# EAGLE design adaptador_vga_scart (EAGLE 6.5.0)
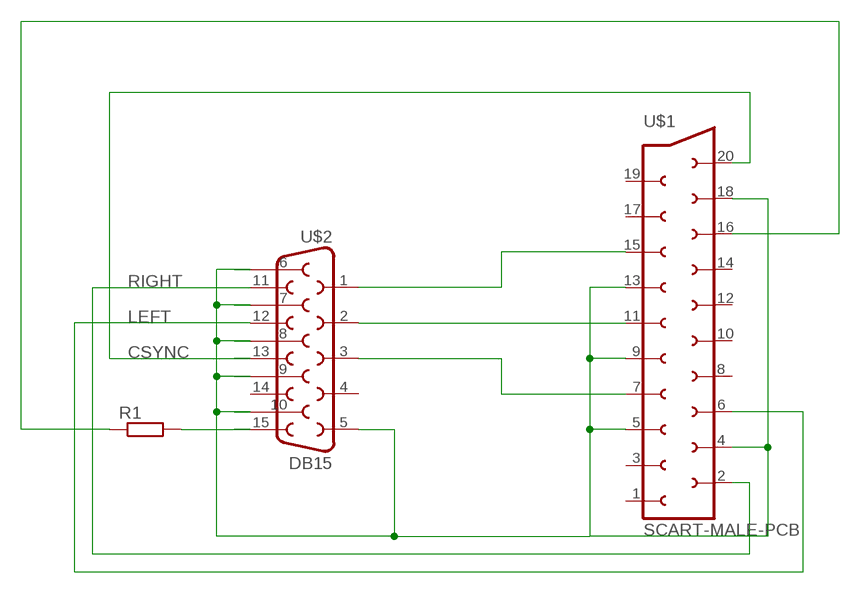
[diagram p0: schematic, sheet 1]

## Parts
R1  R-EU_0204/7  [0204/7]
U$1  SCART-MALE-PCB  [SCART-PCB]
U$2  DB15  [DB15]

## Nets
BOUT: U$1.7 U$2.3
CSYNC: U$1.20 U$2.13
GND: U$1.4 U$1.5 U$1.9 U$1.13 U$1.18 U$2.5 U$2.6 U$2.7 U$2.8 U$2.9 U$2.10
GOUT: U$1.11 U$2.2
LEFT: U$1.6 U$2.12
N$1: U$1.15 U$2.1
N$2: R1.2 U$2.15
N$3: R1.1 U$1.16
RIGHT: U$1.2 U$2.11
Unconnected: U$1.1 U$1.3 U$1.8 U$1.10 U$1.12 U$1.14 U$1.17 U$1.19 U$2.4 U$2.14

## Library data of the parts
R1 = rcl:R-EU_: RESISTOR, European symbol
U$1 = con-hirschmann:SCART-MALE-PCB
U$2 = SparkFun-Connectors:DB15: DB15 / VGA right angle through-hole female connector.

## Board
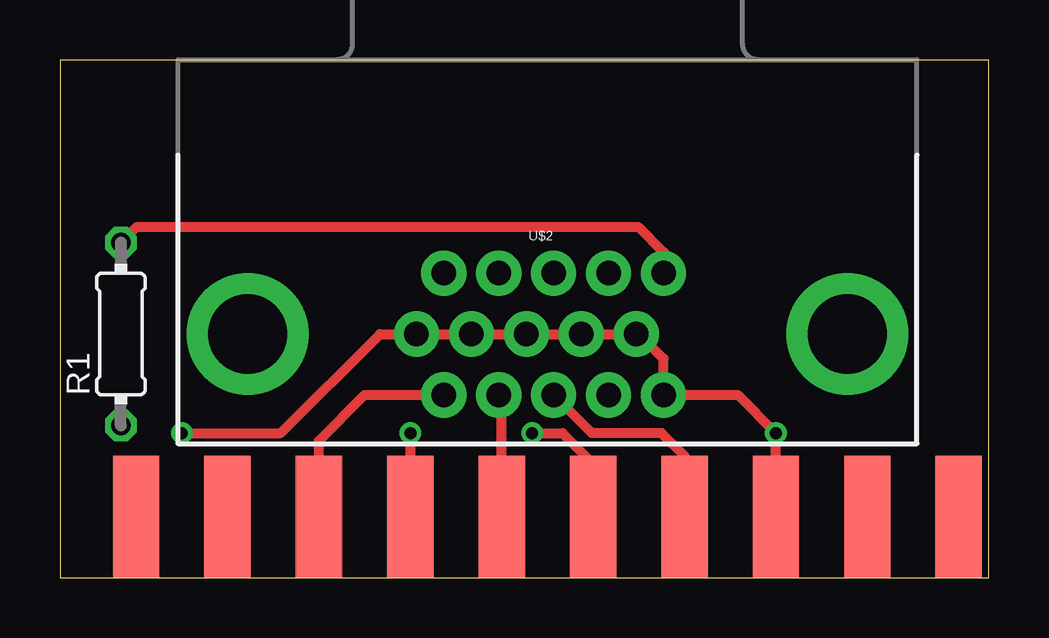
[diagram p1: board, top side]
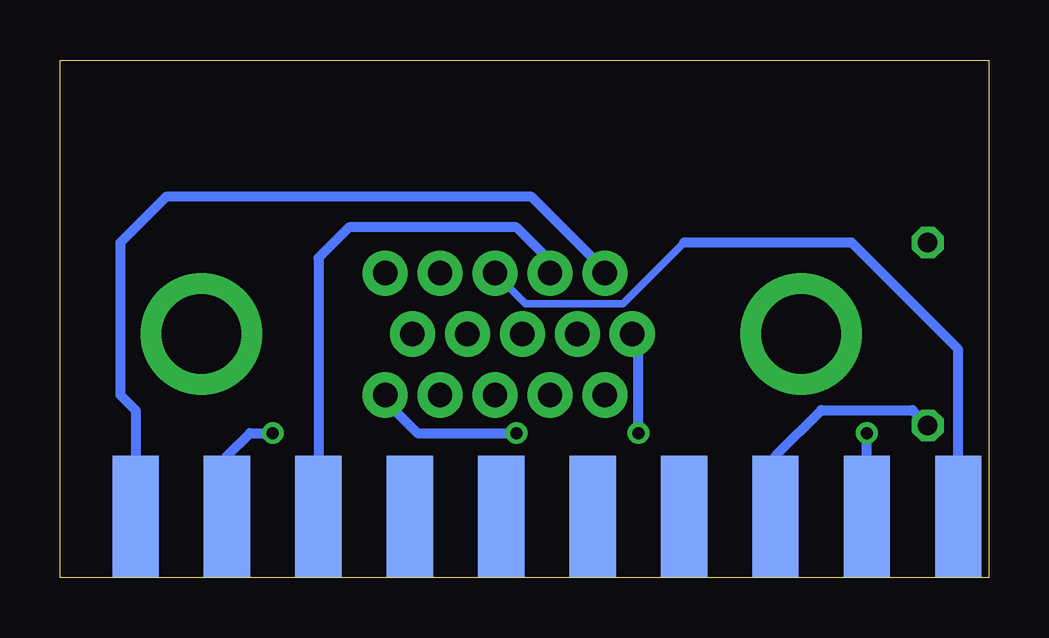
[diagram p2: board, bottom side, seen from below]

Size 38.72 x 21.58 mm. Coordinates in mm from the lower left corner, seen from the top.
Outline: 0,0 38.72,0 38.72,21.58 0,21.58 0,0
Copper layers (1*16): Top 0.035mm / dielectric 1.5mm / Bottom 0.035mm
Design rules "default": minimum track width 10mil, minimum drill 24mil, track to track 8mil, track to pad 8mil, pad to pad 8mil, via to via 8mil, smd to smd 8mil, copper to edge 40mil, drill to drill 8mil, minimum pad ring 10mil, minimum via ring 8mil, stop-mask expansion 4mil, vias tented up to drill 0mil, thermal gap 10mil

### Footprints (pad centres in the part's own frame; a part is rotated, then mirrored left to right if it is on the bottom)
0204/7 = drill 0.813 octagon: 1 -3.81,0; 2 3.81,0
SCART-PCB = smd 1.93 x 5.08: 1 17.145,0; 3 13.335,0; 5 9.525,0; 7 5.715,0; 9 1.905,0; 11 -1.905,0; 13 -5.715,0; 15 -9.525,0; 17 -13.335,0; 19 -17.145,0 | smd 1.93 x 5.08 bottom: 2 15.24,0; 4 11.43,0; 6 7.62,0; 8 3.81,0; 10 0,0; 12 -3.81,0; 14 -7.62,0; 16 -11.43,0; 18 -15.24,0; 20 -19.05,0
DB15 = drill 1.016 pad 1.88: 1 -4.32,-7.62; 2 -2.03,-7.62; 3 0.26,-7.62; 4 2.55,-7.62; 5 4.84,-7.62; 6 -5.46,-5.08; 7 -3.17,-5.08; 8 -0.88,-5.08; 9 1.41,-5.08; 10 3.7,-5.08; 11 -4.32,-2.54; 12 -2.03,-2.54; 13 0.26,-2.54; 14 2.55,-2.54; 15 4.84,-2.54 | drill 3.302 pad 5.08: G1 -12.5,-5.08; G2 12.5,-5.08

### Placement (x,y rotation side)
R1  2.54,10.16 90 top
U$1  20.32,2.54 0 top
U$2  20.32,15.24 0 top

### Tracks (layer width: path | path; a pad name or v marks a point on that pad's centre or on a via)
BOUT
  Top 0.406: U$1.7 26.04,5.08 25.08,6.03 22.17,6.03 U$2.3
CSYNC
  Bottom 0.305: 12.7,13.97 15.24,11.43 19.31,11.43 U$2.13
  Bottom 0.406: U$1.20 1.27,9.53 5.71,13.97 12.7,13.97
GND  (via drill 0.5)
  Top 0.406: v19.68,6.03 20.95,6.03 22.23,4.76 U$1.9 | U$1.13 v14.61,6.03 | U$1.5 v29.84,6.03 28.26,7.62 U$2.5 25.16,9.13 24.13,10.16 U$2.10 U$2.9 U$2.8 U$2.7 U$2.6 13.34,10.16 9.21,6.03 v5.08,6.03
  Bottom 0.406: U$2.5 25.16,7.38 23.81,6.03 v19.68,6.03 | v14.61,6.03 14.61,9.9 U$2.6 | U$1.4 31.75,5.08 30.8,6.03 v29.84,6.03 | U$1.18 v5.08,6.03
GOUT
  Top 0.406: U$1.11 18.41,7.5 U$2.2
LEFT
  Bottom 0.406: U$2.12 18.29,13.21 19.68,14.61 26.67,14.61 27.94,13.34 U$1.6
N$1
  Top 0.406: U$1.15 10.79,5.71 12.7,7.62 U$2.1
N$2
  Top 0.406: U$2.15 25.16,13.57 24.13,14.61 3.17,14.61 R1.2
N$3
  Bottom 0.406: U$1.16 8.89,5.08 6.99,6.99 3.17,6.99 R1.1
RIGHT
  Bottom 0.406: U$2.11 16,12.82 19.05,15.88 34.29,15.88 36.2,13.97 36.2,7.62 35.56,6.99 U$1.2